# EAGLE design xbee_controller (EAGLE 6.5.0)
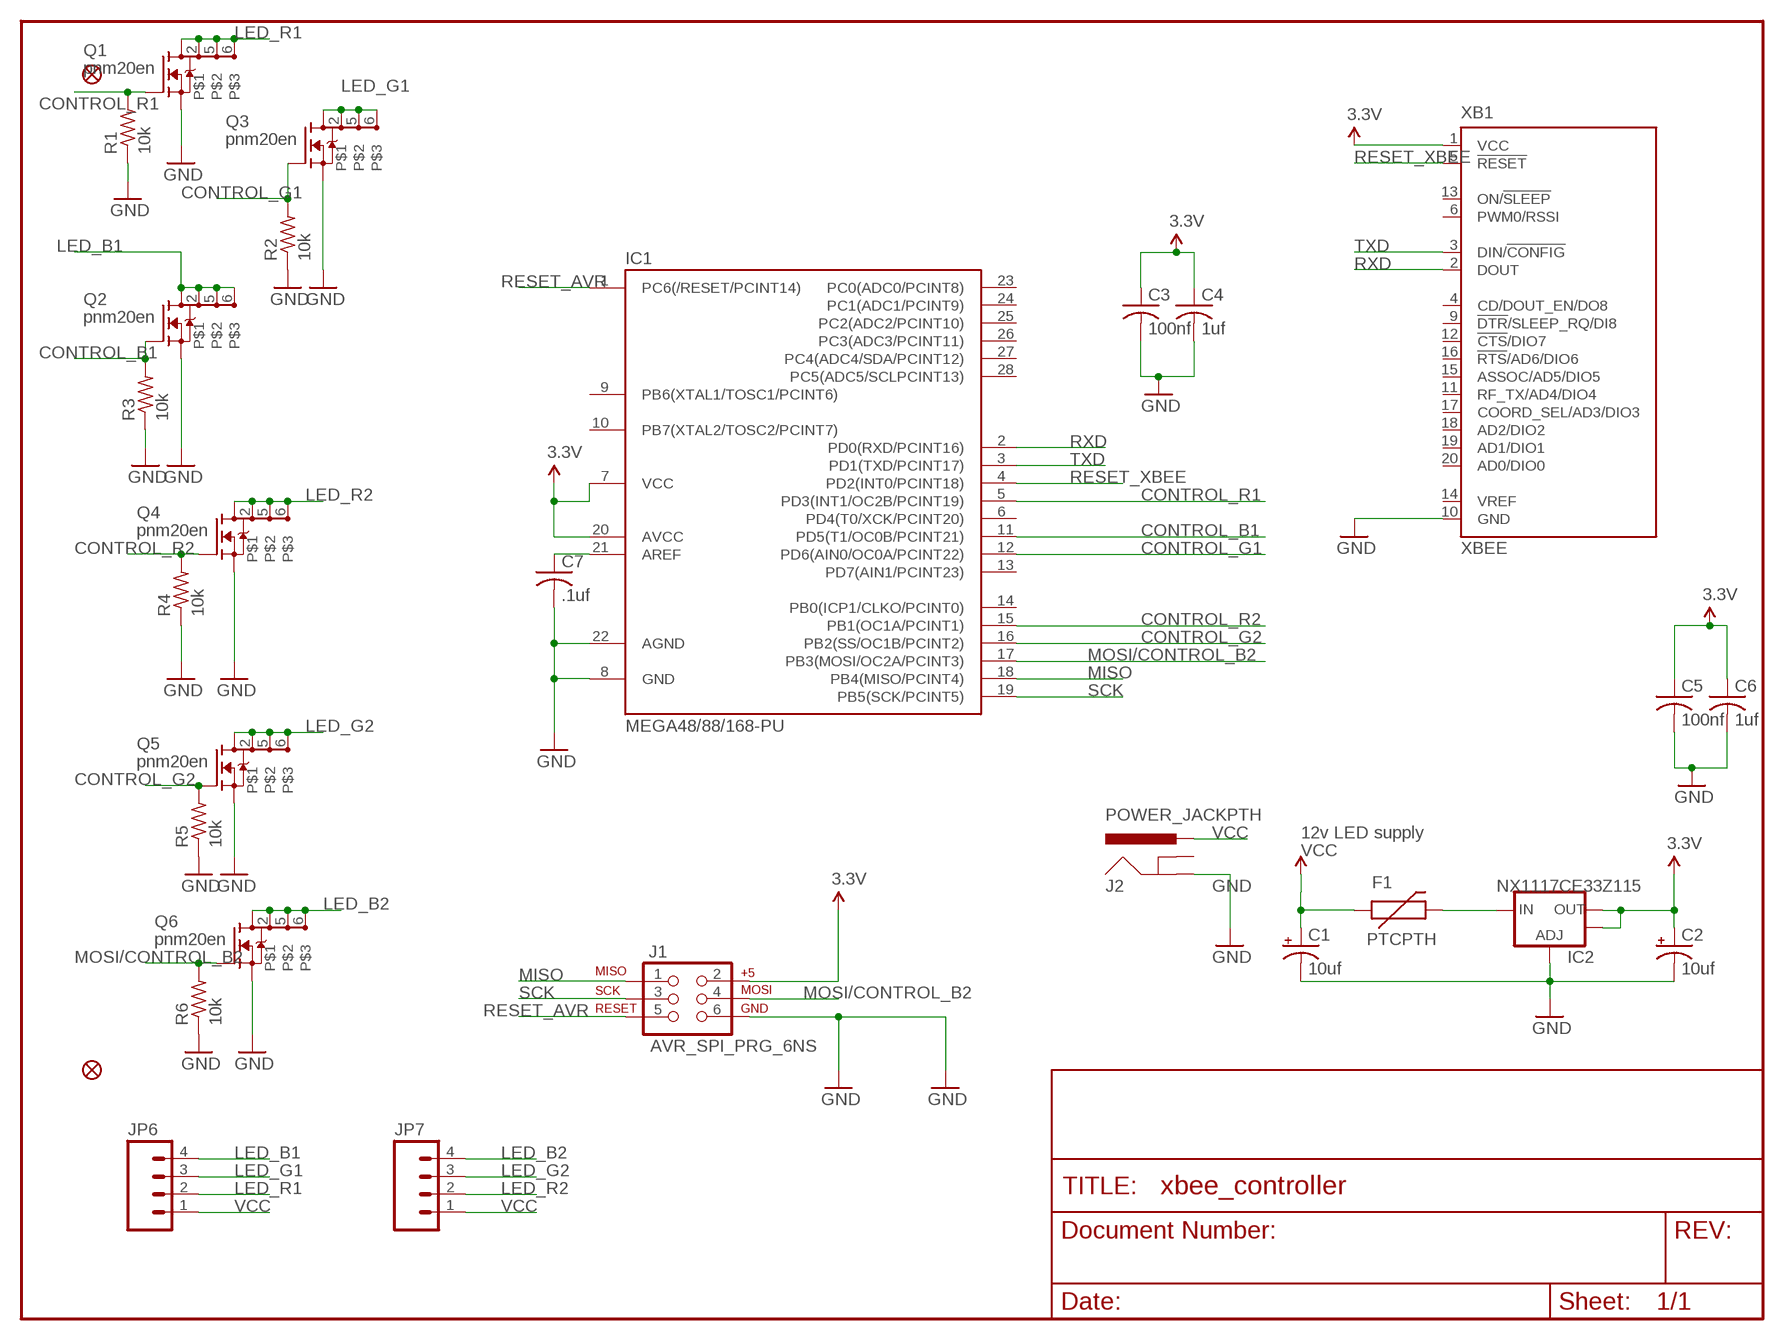
[diagram p0: schematic, sheet 1]

## Parts
C1  10uf  CPOL-USA  [PANASONIC_A]
C2  10uf  CPOL-USA  [PANASONIC_A]
C3  100nf  C-USC0603  [C0603]
C4  1uf  C-USC0603  [C0603]
C5  100nf  C-USC0603  [C0603]
C6  1uf  C-USC0603  [C0603]
C7  .1uf  C-USC0603  [C0603]
F1  PTCPTH  [PTC]
IC1  MEGA48/88/168-PU  [DIL28-3]
IC2  NX1117CE33Z115  V_REG_LM1117SOT223  [SOT223]
J1  AVR_SPI_PRG_6NS  [2X3-NS]
J2  POWER_JACKPTH  [POWER_JACK_PTH]
JP2  FIDUCIAL1.5X3  [FIDUCIAL-1.5X3]
JP5  FIDUCIAL1.5X3  [FIDUCIAL-1.5X3]
JP6  M04SCREW  [SCREWTERMINAL-3.5MM-4]
JP7  M04SCREW  [SCREWTERMINAL-3.5MM-4]
Q1  pnm20en  PMN20EN  [BCR405U]
Q2  pnm20en  PMN20EN  [BCR405U]
Q3  pnm20en  PMN20EN  [BCR405U]
Q4  pnm20en  PMN20EN  [BCR405U]
Q5  pnm20en  PMN20EN  [BCR405U]
Q6  pnm20en  PMN20EN  [BCR405U]
R1  10k  R-US_R0603  [R0603]
R2  10k  R-US_R0603  [R0603]
R3  10k  R-US_R0603  [R0603]
R4  10k  R-US_R0603  [R0603]
R5  10k  R-US_R0603  [R0603]
R6  10k  R-US_R0603  [R0603]
XB1  XBEE  [XBEE]

## Nets
3.3V [power]: C2.+ C3.1 C4.1 C5.1 C6.1 IC1.7(VCC) IC1.20(AVCC) IC2.2(OUT) IC2.4(OUT) J1.2 XB1.1(VCC)
CONTROL_B1: IC1.11(PD5(T1/OC0B/PCINT21)) Q2.3(G) R3.2
CONTROL_G1: IC1.12(PD6(AIN0/OC0A/PCINT22)) Q3.3(G) R2.2
CONTROL_G2: IC1.16(PB2(SS/OC1B/PCINT2)) Q5.3(G) R5.2
CONTROL_R1: IC1.5(PD3(INT1/OC2B/PCINT19)) Q1.3(G) R1.2
CONTROL_R2: IC1.15(PB1(OC1A/PCINT1)) Q4.3(G) R4.2
GND [power]: C1.- C2.- C3.2 C4.2 C5.2 C6.2 C7.2 IC1.8(GND) IC1.22(AGND) IC2.1(ADJ) J1.6 J2.GND Q1.4(S) Q2.4(S) Q3.4(S) Q4.4(S) Q5.4(S) Q6.4(S) R1.1 R2.1 R3.1 R4.1 R5.1 R6.1 XB1.10(GND)
LED_B1 [power]: JP6.4 Q2.1(D) Q2.2 Q2.5 Q2.6
LED_B2 [power]: JP7.4 Q6.1(D) Q6.2 Q6.5 Q6.6
LED_G1 [power]: JP6.3 Q3.1(D) Q3.2 Q3.5 Q3.6
LED_G2 [power]: JP7.3 Q5.1(D) Q5.2 Q5.5 Q5.6
LED_R1 [power]: JP6.2 Q1.1(D) Q1.2 Q1.5 Q1.6
LED_R2 [power]: JP7.2 Q4.1(D) Q4.2 Q4.5 Q4.6
MISO: IC1.18(PB4(MISO/PCINT4)) J1.1
MOSI/CONTROL_B2: IC1.17(PB3(MOSI/OC2A/PCINT3)) J1.4 Q6.3(G) R6.2
N$1 [power]: F1.P$2 IC2.3(IN)
N$2: C7.1 IC1.21(AREF)
RESET_AVR: IC1.1(PC6(/RESET/PCINT14)) J1.5
RESET_XBEE: IC1.4(PD2(INT0/PCINT18)) XB1.5(!RESET)
RXD: IC1.2(PD0(RXD/PCINT16)) XB1.2(DOUT)
SCK: IC1.19(PB5(SCK/PCINT5)) J1.3
TXD: IC1.3(PD1(TXD/PCINT17)) XB1.3(DIN/!CONFIG)
VCC [power]: C1.+ F1.P$1 J2.PWR JP6.1 JP7.1
Unconnected: IC1.6(PD4(T0/XCK/PCINT20)) IC1.9(PB6(XTAL1/TOSC1/PCINT6)) IC1.10(PB7(XTAL2/TOSC2/PCINT7)) IC1.13(PD7(AIN1/PCINT23)) IC1.14(PB0(ICP1/CLKO/PCINT0)) IC1.23(PC0(ADC0/PCINT8)) IC1.24(PC1(ADC1/PCINT9)) IC1.25(PC2(ADC2/PCINT10)) IC1.26(PC3(ADC3/PCINT11)) IC1.27(PC4(ADC4/SDA/PCINT12)) IC1.28(PC5(ADC5/SCLPCINT13)) J2.GNDBREAK XB1.4(CD/DOUT_EN/DO8) XB1.6(PWM0/RSSI) XB1.9(!DTR!/SLEEP_RQ/DI8) XB1.11(RF_TX/AD4/DIO4) XB1.12(!CTS!/DIO7) XB1.13(ON/!SLEEP) XB1.14(VREF) XB1.15(ASSOC/AD5/DIO5) XB1.16(!RTS!/AD6/DIO6) XB1.17(COORD_SEL/AD3/DIO3) XB1.18(AD2/DIO2) XB1.19(AD1/DIO1) XB1.20(AD0/DIO0)

## Notes on the sheet
- 12v LED supply

## Library data of the parts
C1 C2 = rcl:CPOL-US: POLARIZED CAPACITOR, American symbol
C3-C7 = rcl:C-US: CAPACITOR, American symbol
F1 = SparkFun:PTC: Resettable Fuse PTC Resettable Fuse. Spark Fun Electronics SKU : COM-08357
IC1 = avr-7:MEGA48/88/168-PU
IC2 = SparkFun:V_REG_LM1117: Voltage Regulator LM1117 Standard adjustable voltage regulator but in SMD form. Spark Fun Electronics SKU : COM-00595
J1 = SparkFun:AVR_SPI_PRG_6: AVR ISP 6 Pin This is the reduced ISP connector for AVR programming. Common on Arduino. This footprint will take up less PCB space and can be used with a 10-pin to 6-pin adapter such as SKU: BOB-08508
J2 = SparkFun:POWER_JACK: Power Jack This is the standard 5.5mm barrel jack for power. The PTH is the most common, proven, reliable, footprint. All others are experimental. The Slot footprint only works if the mill layer is transmitted to the PCB fab house so be warned. Spark Fun Electronics SKU : PRT-00119. Mating wall wart : TOL-00298 (and others)
JP2 JP5 = SparkFun:FIDUCIAL: Fiducial Alignment Points Various fiducial points for machine vision alignment.
JP6 JP7 = SparkFun:M04: Header 4 Standard 4-pin 0.1" header. Use with straight break away headers (SKU : PRT-00116), right angle break away headers (PRT-00553), swiss pins (PRT-00743), machine pins (PRT-00117), and female headers (PRT-00115). Molex polarized connector foot print use with SKU : PRT-08231 with associated crimp pins and housings. 1MM SMD Version SKU: PRT-10208
Q1-Q6 = c-infineon:PMN20EN
R1-R6 = rcl:R-US_: RESISTOR, American symbol
XB1 = maxstream:XBEE: XBee (TM) /XBee-PRO(TM) OEM RF Modules Source: MaxStream, Inc. xbee_productmanual.pdf; MPN: XBP24-Z7UIT-004; OC_FARNELL: 1751799; OC_NEWARK: 34R5507

## Net classes
0 default: clearance 0.203 mm
1 power: width 0.61 mm, clearance 0.203 mm

## Board
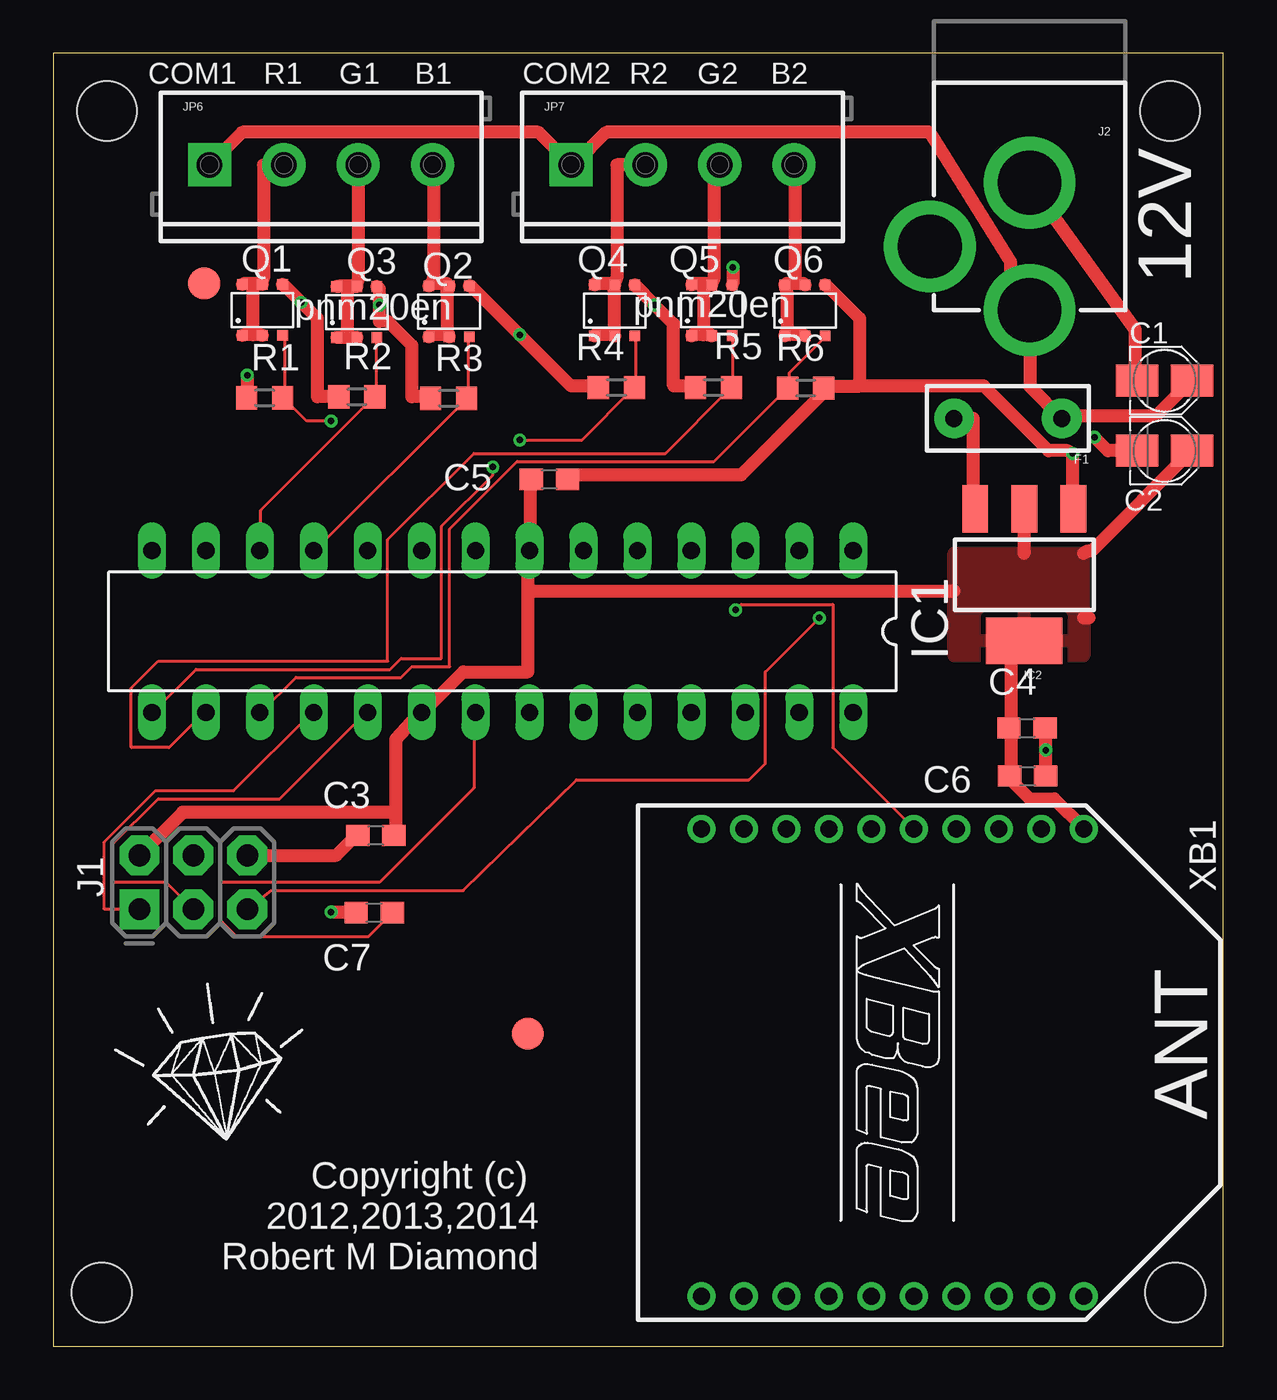
[diagram p1: board, top side]
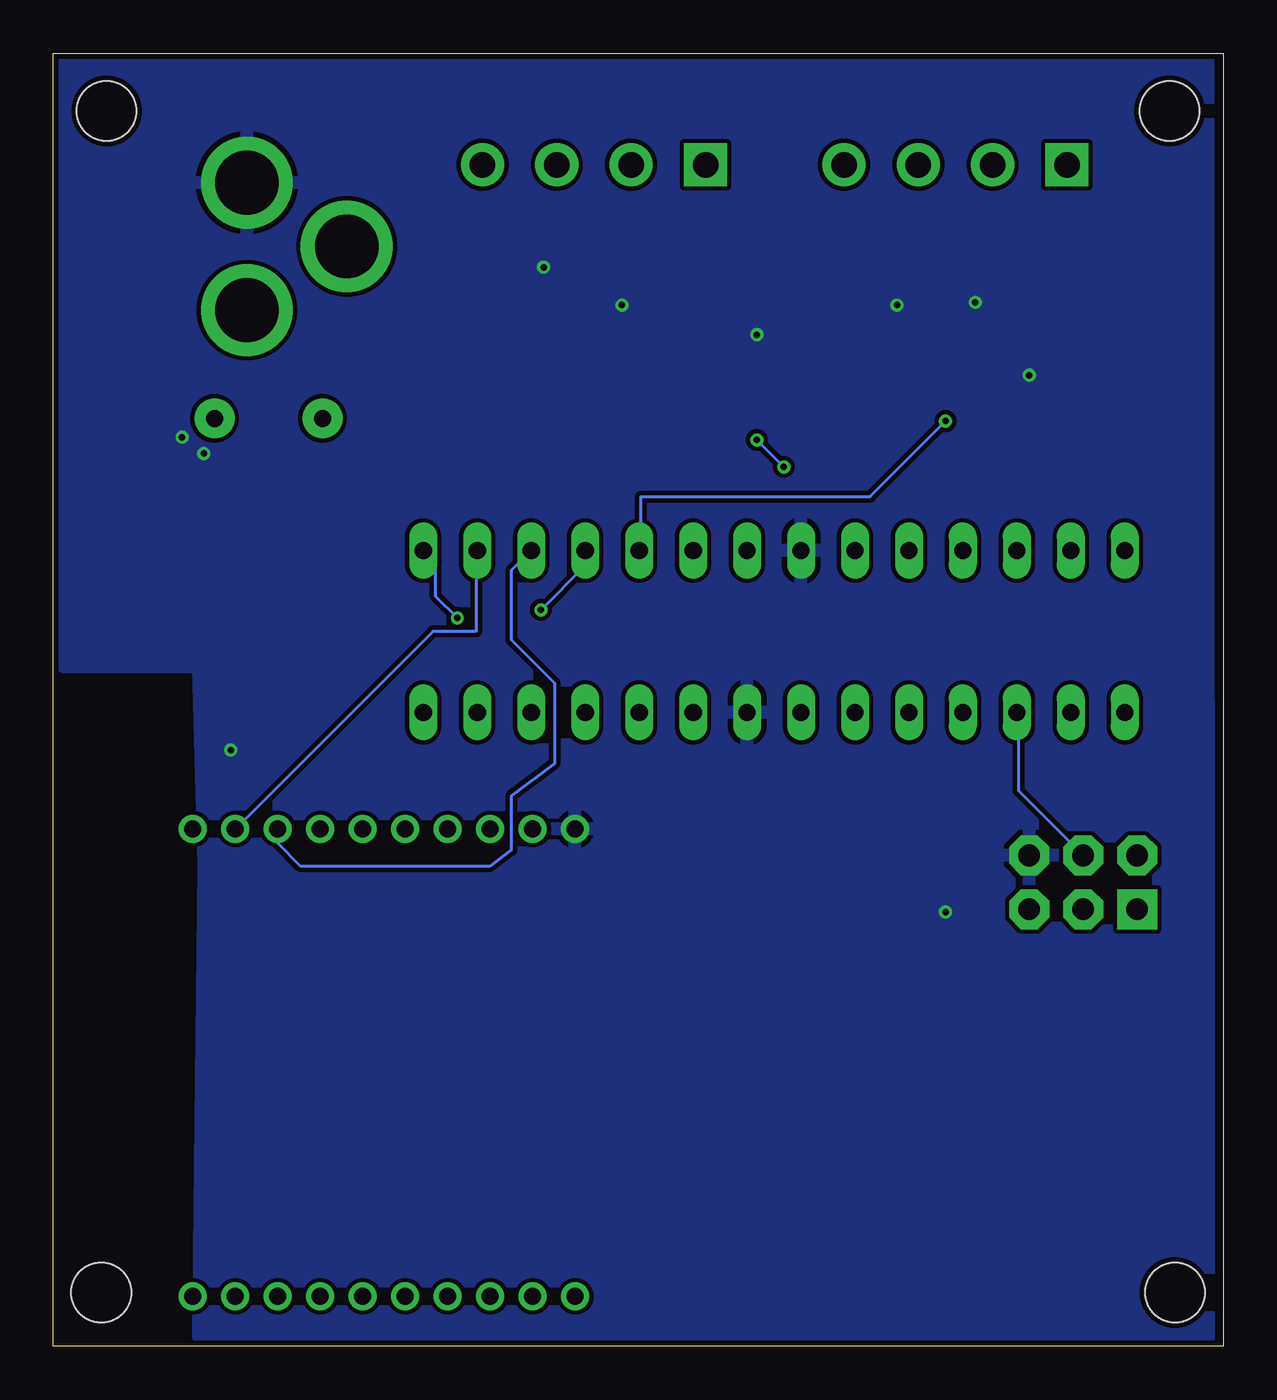
[diagram p2: board, bottom side, seen from below]

Size 55.1 x 60.88 mm. Coordinates in mm from the lower left corner, seen from the top.
Outline: 0,0 55.1,0 55.1,60.88 0,60.88 0,0
Copper layers (1*16): Top 0.035mm / dielectric 1.5mm / Bottom 0.035mm
Design rules "Fusion_eagle_rule_v1.1": minimum track width 6mil, minimum drill 12mil, track to track 6mil, track to pad 6mil, pad to pad 6mil, via to via 6mil, smd to smd 0mil, copper to edge 10mil, drill to drill 10mil, minimum pad ring 10mil, minimum via ring 6mil, stop-mask expansion 2mil, vias tented up to drill 100mil, thermal gap 10mil
Holes 2.8 mm at 2.54,58.17 2.29,2.54 52.83,2.54 52.58,58.17

### Footprints (pad centres in the part's own frame; a part is rotated, then mirrored left to right if it is on the bottom)
PANASONIC_A = smd 2 x 1.5: + 1.3,0; - -1.3,0
C0603 = smd 1.1 x 1: 1 -0.85,0; 2 0.85,0
PTC = drill 0.8 pad 1.88: P$1 -2.54,0; P$2 2.54,0
DIL28-3 = drill 0.813 long: 1 -16.51,-3.81; 2 -13.97,-3.81; 3 -11.43,-3.81; 4 -8.89,-3.81; 5 -6.35,-3.81; 6 -3.81,-3.81; 7 -1.27,-3.81; 8 1.27,-3.81; 9 3.81,-3.81; 10 6.35,-3.81; 11 8.89,-3.81; 12 11.43,-3.81; 13 13.97,-3.81; 14 16.51,-3.81; 15 16.51,3.81; 16 13.97,3.81; 17 11.43,3.81; 18 8.89,3.81; 19 6.35,3.81; 20 3.81,3.81; 21 1.27,3.81; 22 -1.27,3.81; 23 -3.81,3.81; 24 -6.35,3.81; 25 -8.89,3.81; 26 -11.43,3.81; 27 -13.97,3.81; 28 -16.51,3.81
SOT223 = smd 1.219 x 2.235: 1 -2.311,-3.099; 2 0,-3.099; 3 2.311,-3.099 | smd 3.6 x 2.2: 4 0,3.099
2X3-NS = drill 1.016 pad 1.88 square: 1 -2.54,-1.27 | drill 1.016 pad 1.88 octagon: 2 -2.54,1.27; 3 0,-1.27; 4 0,1.27; 5 2.54,-1.27; 6 2.54,1.27
POWER_JACK_PTH = drill 2.997 pad 4.318: GND 0,7.7; GNDBREAK 4.7,10.7; PWR 0,13.7
FIDUCIAL-1.5X3 = smd 1.5 x 1.5: 1 0,0
SCREWTERMINAL-3.5MM-4 = drill 1.2 pad 2.032 square: 1 0,0 | drill 1.2 pad 2.032: 2 3.5,0; 3 7,0; 4 10.5,0
BCR405U = smd 0.5 x 0.5: 1 -0.95,-1.2; 2 0,-1.2; 3 0.95,-1.2; 4 0.95,1.2; 5 0,1.2; 6 -0.95,1.2
R0603 = smd 1 x 1.1: 1 -0.85,0; 2 0.85,0
XBEE = drill 0.8 pad 1.27: 1 -11,9; 2 -11,7; 3 -11,5; 4 -11,3; 5 -11,1; 6 -11,-1; 7 -11,-3; 8 -11,-5; 9 -11,-7; 10 -11,-9; 11 11,-9; 12 11,-7; 13 11,-5; 14 11,-3; 15 11,-1; 16 11,1; 17 11,3; 18 11,5; 19 11,7; 20 11,9

### Placement (x,y rotation side)
C1  52.32,45.47 0 top
C2  52.32,42.16 0 top
C3  15.19,24.05 180 top
C4  45.85,29.11 0 top
C5  23.37,40.82 0 top
C6  45.87,26.85 0 top
C7  15.11,20.42 180 top
F1  44.96,43.69 180 top
IC1  21.16,33.66 180 top
IC2  45.72,36.32 180 top
J1  6.6,21.84 0 top
J2  45.97,62.48 180 top
JP2  22.35,14.73 0 top
JP5  7.11,50.04 0 top
JP6  7.37,55.63 0 top
JP7  24.38,55.63 0 top
Q1  9.86,48.79 0 top
Q2  18.64,48.72 0 top
Q3  14.3,48.69 0 top
Q4  26.44,48.77 0 top
Q5  31.01,48.78 0 top
Q6  35.4,48.77 0 top
R1  9.96,44.65 0 top
R2  14.3,44.7 0 top
R3  18.62,44.63 0 top
R4  26.52,45.14 0 top
R5  31.09,45.14 0 top
R6  35.43,45.11 180 top
XB1  39.52,13.36 270 top

### Tracks (layer width: path | path; a pad name or v marks a point on that pad's centre or on a via)
3.3V
  Top 0.61: IC2.2 45.72,39.37 45.72,37.47 45.72,37.34 | C5.1 22.48,40.77 22.48,37.47 IC1.7 22.35,37.21 22.35,35.56 | 16.13,25.15 16.13,28.57 17.27,29.84 IC1.20 17.53,29.97 19.3,31.75 22.35,31.75 22.35,35.56 | 16.13,25.15 16.13,24.13 C3.1 | J1.2 6.1,25.15 15.88,25.15 16.13,25.15 | 42.42,35.56 42.29,35.56 22.61,35.56 22.35,35.56 | 48.77,34.29 48.51,34.29 | IC2.4 45.09,32.77 45.09,29.34 C4.1 45.09,29.08 45.09,26.92 C6.1 45.09,26.67 45.97,25.78 47.12,25.78 48.51,24.38 XB1.1 | C2.+ 53.59,42.16 48.9,37.47 48.77,37.47 48.51,37.34
  pour Top: 42.42,37.34 48.51,37.34 48.51,32.51 42.42,32.51
CONTROL_B1
  Top 0.152: Q2.3 19.56,47.5 19.56,44.7 R3.2 19.43,44.58 12.32,37.47 IC1.11
CONTROL_G1
  Top 0.152: Q3.3 15.24,47.37 15.24,44.7 R2.2 15.11,44.7 9.78,39.37 9.78,37.47 IC1.12
CONTROL_G2
  Top 0.152: Q5.3 32,47.5 32,45.21 R5.2 31.88,45.09 28.83,42.04 19.81,42.04 15.75,37.97 15.75,32.26 4.95,32.26 3.68,30.99 3.68,28.19 5.46,28.19 7.11,29.84 IC1.16
CONTROL_R1  (via drill 0.3)
  Top 0.152: Q1.3 10.92,47.5 10.92,44.7 R1.2 10.92,44.58 11.94,43.56 v13.08,43.56
  Bottom 0.152: v13.08,43.56 16.64,40.01 27.43,40.01 27.43,37.47 IC1.5
CONTROL_R2  (via drill 0.3)
  Top 0.152: Q4.3 27.43,47.5 27.43,45.21 R4.2 27.3,45.09 24.89,42.67 v21.97,42.67 | v20.7,41.4 20.7,41.02 18.29,38.61 18.29,32.38 16.38,32.38 15.88,31.88 6.73,31.88 4.7,29.84 IC1.15
  Bottom 0.152: v20.7,41.4 v21.97,42.67
GND  (via drill 0.3)
  Top 0.61: 37.97,45.21 37.97,48.39 36.45,49.91 Q6.4 | 37.97,45.21 36.32,45.21 R6.1 36.2,44.83 32.38,41.02 24.38,41.02 24.26,40.89 C5.2 | Q2.4 19.68,49.91 v21.97,47.62 24.38,45.21 25.65,45.21 R4.1 | Q1.4 10.92,49.91 v11.68,49.15 12.45,48.39 12.45,44.7 13.34,44.7 R2.1 | Q3.4 15.37,49.78 v15.37,49.02 15.37,48.26 15.75,48.26 16.89,47.12 16.89,44.7 17.65,44.7 R3.1 | Q4.4 27.43,49.91 v28.32,49.02 29.21,48.13 29.21,45.21 30.23,45.21 R5.1 | v32,50.8 32,50.04 Q5.4 | IC2.1 48.01,39.5 v48.01,42.04 47.75,42.16 46.86,42.16 43.81,45.21 38.23,45.21 37.97,45.21 | v13.08,20.45 14.22,20.45 C7.2 | J1.6 13.34,23.11 14.22,24 C3.2 | v9.14,45.72 9.14,44.7 R1.1 | C4.2 46.74,29.08 v46.74,28.07 46.74,26.92 C6.2 | v49.02,42.8 49.66,42.16 50.93,42.16 C2.- | C1.- 50.93,45.47 50.93,47.88 45.97,54.74 J2.GND
  pour Bottom: 54.58,60.5 54.61,32 48.26,32 48.01,22.61 48.26,0.46 0.69,0.46 0.71,60.5
LED_B1
  Top 0.61: 18.54,47.62 17.78,47.62 Q2.1 | 18.54,47.62 Q2.2 | 17.91,50.04 18.54,50.04 Q2.5 18.54,49.66 18.54,47.88 18.54,47.62 | 17.91,50.04 17.78,50.04 Q2.6 | 17.91,50.04 17.91,50.29 17.91,55.63 JP6.4
LED_B2
  Top 0.61: 34.54,47.62 35.31,47.62 Q6.2 | 34.54,47.62 Q6.1 | 34.92,50.04 35.31,50.04 Q6.5 | 34.92,50.04 34.54,50.04 Q6.6 34.54,49.66 34.54,47.88 34.54,47.62 | 34.92,50.04 34.92,50.29 34.92,55.63 JP7.4
LED_G1
  Top 0.61: 13.84,47.5 14.22,47.5 Q3.2 | 13.84,47.5 13.46,47.5 Q3.1 | 14.22,49.91 13.84,49.91 | 13.84,49.91 13.46,49.91 Q3.6 | 14.22,49.91 Q3.5 | 13.84,47.5 13.84,47.75 13.84,49.66 13.84,49.91 | 14.22,49.91 14.35,50.16 14.35,55.63 JP6.3
LED_G2
  Top 0.61: 30.61,47.62 30.99,47.62 Q5.2 | 30.61,47.62 30.1,47.62 Q5.1 | 30.99,50.04 30.61,50.04 | 30.61,50.04 30.1,50.04 Q5.6 | 30.99,50.04 Q5.5 | 30.61,47.62 30.61,47.88 30.61,49.78 30.61,50.04 | 30.99,50.04 31.11,50.29 31.11,55.63 JP7.3
LED_R1
  Top 0.61: 9.4,47.62 9.78,47.62 Q1.2 | 9.4,47.62 9.02,47.62 Q1.1 | 9.78,50.04 9.4,50.04 | 9.4,50.04 9.02,50.04 Q1.6 | 9.78,50.04 Q1.5 | 9.4,47.62 9.4,47.88 9.4,49.78 9.4,50.04 | 9.78,50.04 9.91,50.29 9.91,55.63 10.79,55.63 JP6.2
LED_R2
  Top 0.61: 26.42,47.62 25.53,47.62 Q4.1 | 26.42,47.62 Q4.2 | 26.42,50.04 25.53,50.04 Q4.6 | 26.42,50.04 Q4.5 26.42,49.66 26.42,47.88 26.42,47.62 | 26.42,50.04 26.54,50.29 26.54,55.63 27.81,55.63 JP7.2
MISO
  Top 0.152: J1.1 2.41,20.57 2.41,23.75 4.83,26.16 8.51,26.16 12.19,29.84 IC1.18
MOSI/CONTROL_B2
  Top 0.152: Q6.3 36.32,47.5 34.67,45.85 34.67,45.21 R6.2 34.54,45.09 31.11,41.66 21.84,41.66 18.67,38.48 18.67,32 16.89,32 16.38,31.5 11.43,31.5 9.78,29.84 IC1.17
  Bottom 0.152: J1.4 9.65,26.16 9.65,29.84 IC1.17
N$1
  Top 0.61: F1.P$2 43.31,43.69 43.31,39.5 IC2.3
N$2
  Top 0.152: C7.1 15.88,20.32 14.86,19.3 8.64,19.3 7.87,20.07 7.87,21.84 15.37,21.84 19.81,26.29 19.81,29.84 IC1.21
RESET_AVR  (via drill 0.3)
  Top 0.152: v36.07,34.29 33.53,31.75 33.53,27.43 32.77,26.68 32.76,26.68 24.64,26.67 19.3,21.46 10.29,21.46 J1.5
  Bottom 0.152: v36.07,34.29 37.08,35.31 37.08,36.96 37.59,37.47 IC1.1
RESET_XBEE  (via drill 0.3)
  Top 0.152: v32.13,34.67 32.38,34.92 36.7,34.92 36.7,28.19 40.51,24.38 XB1.5
  Bottom 0.152: v32.13,34.67 30.1,36.7 30.1,37.47 IC1.4
RXD
  Bottom 0.152: XB1.2 46.48,24.38 37.21,33.66 35.18,33.66 35.18,37.47 IC1.2
SCK
  Top 0.152: J1.3 5.33,21.84 2.79,21.84 2.79,23.62 4.95,25.78 10.67,25.78 14.73,29.84 IC1.19
TXD
  Bottom 0.152: IC1.3 33.53,36.52 33.53,33.27 31.5,31.24 31.5,27.43 33.53,25.91 33.53,23.37 34.54,22.61 43.43,22.61 44.52,23.69 XB1.3
VCC
  Top 0.61: JP6.1 8.89,57.15 22.86,57.15 JP7.1 24.64,55.75 26.04,57.15 41.27,57.15 45.09,51.05 45.09,50.04 J2.PWR 45.97,48.77 45.97,45.21 F1.P$1 47.75,43.81 51.94,43.81 53.59,45.47 C1.+

### Text on the board
tNames: COM1 | R2 | G2 | R1 | G1 | B1 | COM2 | B2 | 12V | ANT | Copyright (c) / 2012,2013,2014 / Robert M Diamond